# Altium schematic sheet Sheet1.SchDoc
size A4; SheetNumber: 1; SheetTotal: 4
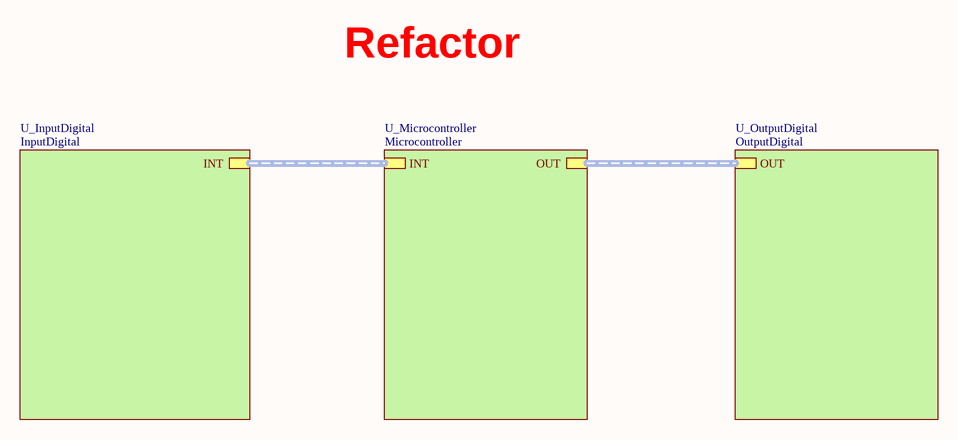
[diagram p0: Sheet1.SchDoc]

## Sub-sheets
U_InputDigital = InputDigital: INT (harness IntDigital)
U_Microcontroller = Microcontroller: INT (harness IntDigital), OUT (harness OutDigital)
U_OutputDigital = OutputDigital: OUT (harness OutDigital)

## Buses and harness runs
harness sheet U_InputDigital/INT = sheet U_Microcontroller/INT
harness sheet U_Microcontroller/OUT = sheet U_OutputDigital/OUT

## Notes on the sheet
- Refactor